# Altium schematic sheet Atmega.SchDoc
size A; SheetNumber: 1; SheetTotal: 1
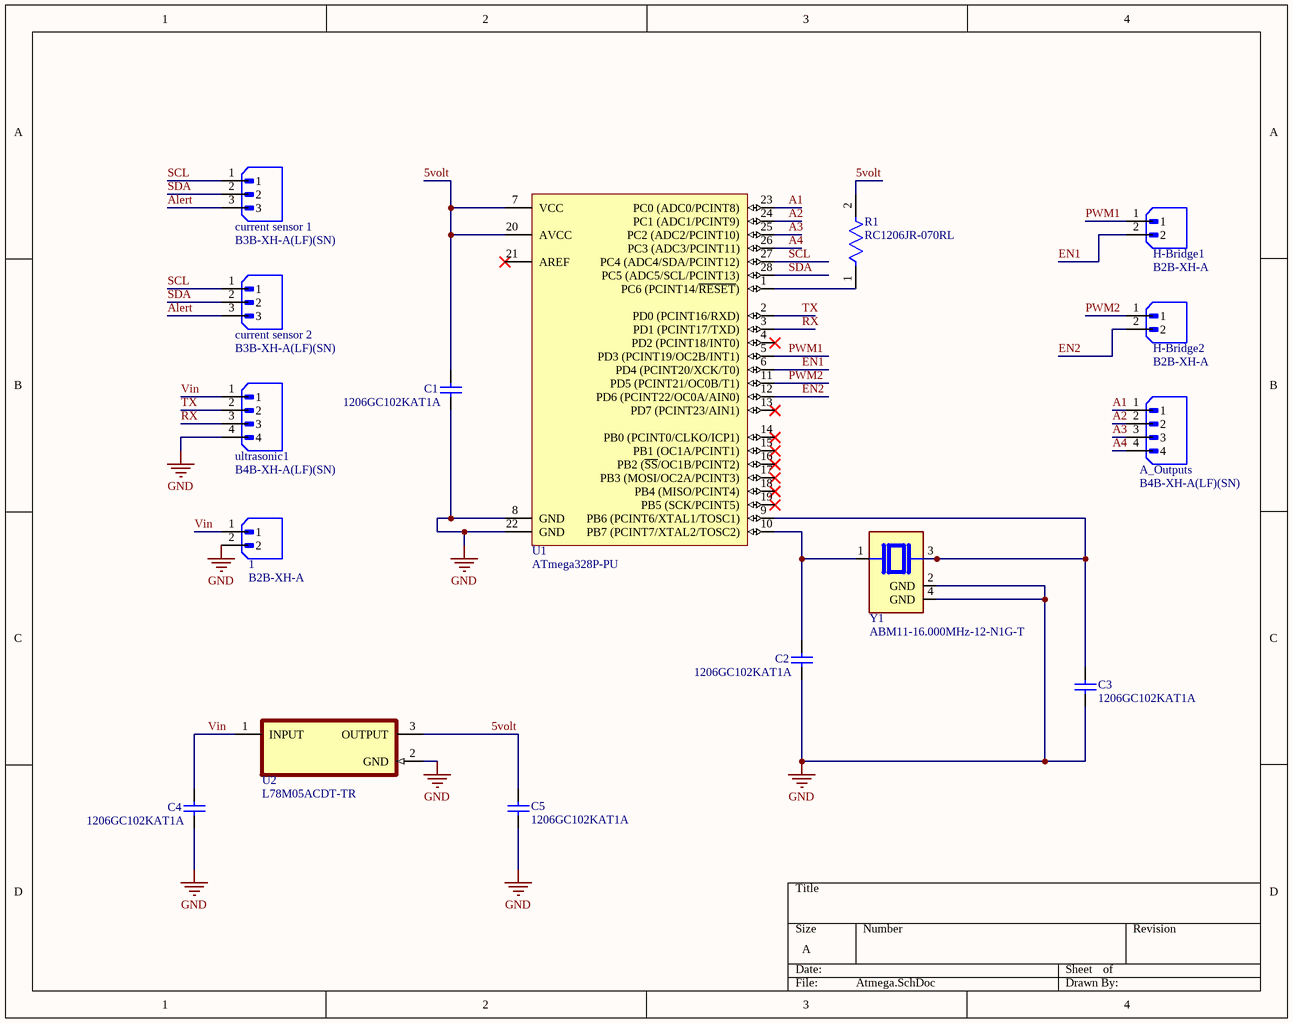
[diagram p0: Atmega.SchDoc]

## Parts
1  B2B-XH-A  [JST_B2B-XH-A]
A_Outputs  B4B-XH-A(LF)(SN)  [JST_B4B-XH-A(LF)(SN)]
C1  1206GC102KAT1A  [AVX-1206-2_L]
C2  1206GC102KAT1A  [AVX-1206-2_L]
C3  1206GC102KAT1A  [AVX-1206-2_L]
C4  1206GC102KAT1A  [AVX-1206-2_L]
C5  1206GC102KAT1A  [AVX-1206-2_L]
current_sensor_1  B3B-XH-A(LF)(SN)  [JST_B3B-XH-A(LF)(SN)]
current_sensor_2  B3B-XH-A(LF)(SN)  [JST_B3B-XH-A(LF)(SN)]
H-Bridge1  B2B-XH-A  [JST_B2B-XH-A]
H-Bridge2  B2B-XH-A  [JST_B2B-XH-A]
R1  RC1206JR-070RL  [FP-RC1206-MFG]
U1  ATmega328P-PU  [28P3]
U2  L78M05ACDT-TR  [DPAK228P972X240-4N]
ultrasonic1  B4B-XH-A(LF)(SN)  [JST_B4B-XH-A(LF)(SN)]
Y1  ABM11-16.000MHz-12-N1G-T  [XTAL_ABM11-16.000MHz-12-N1G-T]

## Nets
GND: 1.2 C1.1 C2.1 C3.1 C4.1 C5.2 U1.8(GND) U1.22(GND) U2.2(GND) ultrasonic1.4 Y1.2(GND) Y1.4(GND)
5volt: C1.2 C5.1 R1.2 U1.7(VCC) U1.20(AVCC) U2.3(OUTPUT)
A1: A_Outputs.1 U1.23(PC0_(ADC0/PCINT8))
A2: A_Outputs.2 U1.24(PC1_(ADC1/PCINT9))
A3: A_Outputs.3 U1.25(PC2_(ADC2/PCINT10))
A4: A_Outputs.4 U1.26(PC3_(ADC3/PCINT11))
Alert: current_sensor_1.3 current_sensor_2.3
EN1: H-Bridge1.2 U1.6(PD4_(PCINT20/XCK/T0))
EN2: H-Bridge2.2 U1.12(PD6_(PCINT22/OC0A/AIN0))
PWM1: H-Bridge1.1 U1.5(PD3_(PCINT19/OC2B/INT1))
PWM2: H-Bridge2.1 U1.11(PD5_(PCINT21/OC0B/T1))
RX: U1.3(PD1_(PCINT17/TXD)) ultrasonic1.3
SCL: current_sensor_1.1 current_sensor_2.1 U1.27(PC4_(ADC4/SDA/PCINT12))
SDA: current_sensor_1.2 current_sensor_2.2 U1.28(PC5_(ADC5/SCL/PCINT13))
TX: U1.2(PD0_(PCINT16/RXD)) ultrasonic1.2
Vin: 1.1 C4.2 U2.1(INPUT) ultrasonic1.1
NetC2_2: C2.2 U1.10(PB7_(PCINT7/XTAL2/TOSC2)) Y1.1
NetC3_2: C3.2 U1.9(PB6_(PCINT6/XTAL1/TOSC1)) Y1.3
NetR1_1: R1.1 U1.1(PC6_(PCINT14/~{RESET}))

Not connected (* = marked no-connect by the designer): U1 4(PD2_(PCINT18/INT0))* 13(PD7_(PCINT23/AIN1))* 14(PB0_(PCINT0/CLKO/ICP1))* 15(PB1_(OC1A/PCINT1))* 16(PB2_(~{SS}/OC1B/PCINT2))* 17(PB3_(MOSI/OC2A/PCINT3))* 18(PB4_(MISO/PCINT4))* 19(PB5_(SCK/PCINT5))* 21(AREF)*

## Library data of the parts
1 H-Bridge1 H-Bridge2 = B2B-XH-A: MF: {'manufacturer': u'JST Sales America Inc.'}; Package: None; Price: None; Value: *; MP: B2B-XH-A; Availability: Unavailable
A_Outputs ultrasonic1 = B4B-XH-A(LF)(SN): Connector Header Through Hole 4 position 0.098 (2.50mm); MF: JST Sales; SnapEDA_Link: https://www.snapeda.com/parts/B4B-XH-A(LF)(SN)/JST+Sales+America+Inc./view-part/?ref=snap; Package: None; Value: *; MP: B4B-XH-A(LF)(SN); Check_prices: https://www.snapeda.com/parts/B4B-XH-A(LF)(SN)/JST+Sales+America+Inc./view-part/?ref=eda
C1-C5 = CMP-2000-05468-1: Chip Capacitor, 1 nF, +/- 10%, -55 to 125 degC, 1206 (3216 Metric), RoHS, Tape and Reel; Manufacturer: AVX; Capacitance: 0.001uF; Dielectric: X7R; Voltage Rating DC: 2000V; Package Reference: 1206; Datasheet Version: 11/2010; Mounting Technology: SurfaceMount; Manufacturer URL: http://www.avx.com/; Tolerance: 10%; Tolerance (%): ±10%; PartNumber: 1206GC102KAT1A; Datasheet URL: https://datasheet.ciiva.com/11787/0900766b80ed4c37-11787781.pdf; Package Description: 2-Pin SMD, Body 3.4 x 1.8 mm; Case Size/Dimension: 1206; Rated Voltage: 2000V
current_sensor_1 current_sensor_2 = B3B-XH-A(LF)(SN): Connector Header Through Hole 3 position 0.098 (2.50mm); MF: JST Sales; SnapEDA_Link: https://www.snapeda.com/parts/B3B-XH-A(LF)(SN)/JST+Sales+America+Inc./view-part/?ref=snap; Package: None; Value: *; MP: B3B-XH-A(LF)(SN); Check_prices: https://www.snapeda.com/parts/B3B-XH-A(LF)(SN)/JST+Sales+America+Inc./view-part/?ref=eda
R1 = CMP-2100-03681-2: RES SMD 0 OHM JUMPER 1/4W 1206; Manufacturer: YAGEO; Voltage Rating: 200V; Temperature Coefficient: 300ppm/°C; Power Rating: 0.25W; Value: 0Ω; Tolerance: 5%; Manufacturer Part Number: RC1206JR-070RL; Temperature Range Low: -55°C; Category: Res; Automotive: No; Ipc Land Pattern Name: RESC310160X55; Device Class L1: Passive Components; Temperature: -55°C to +155°C; ComponentLink2URL: https://www.yageo.com/upload/media/product/productsearch/datasheet/rchip/PYu-RC_Group_51_RoHS_L_10.pdf; Lead Free: Yes; Height: 0.65mm; Footprint Url: https://www.yageo.com/upload/website/yageo_PYu-R_Mount_10_19050818_343.pdf; Package: RC1206; Digikey Description: RES SMD 0 OHM JUMPER 1/4W 1206; Temperature Range High: +155°C; Device Class L3: Chip SMD Resistors; Device Class L2: Resistors; Octopart: https://octopart.com/rc1206jr-070rl-yageo-40025601; Resistance: 0Ω; Series: RC; ComponentLink2Description: Datasheet; Composition: Thick Film; RoHS: TRUE; Mouser Description: Resistor: thick film; SMD; 1206; 0O; 0.25W; ±5%; -55÷155°C
U1 = CMP-0095-00013-2: 8-bit AVR Microcontroller, 32KB Flash, 1KB EEPROM, 2KB SRAM, 28-pin PDIP, Industrial Grade (-40°C to 85°C); RevisionNote: DatasheetVersion updated. URLs added.; PackageVersion: revB, Sep-2001; PackageDescription: 28-lead (0.300"/7.62mm Wide) Plastic Dual Inline Package (PDIP); DatasheetVersion: revD, May-2011; ComponentLink1Description: Manufacturer URL; ComponentLink1URL: http://www.atmel.com/; PackageReference: 28P3; ComponentLink2Description: ATmega48A/48PA/88A/88PA/168A/168PA/328/328P Datasheet; ComponentLink3URL: http://www.atmel.com/dyn/resources/prod_documents/8271S.pdf; ComponentLink2URL: http://www.atmel.com/dyn/resources/prod_documents/8271.pdf; ComponentLink3Description: ATmega48A/48PA/88A/88PA/168A/168PA/328/328P Summary
U2 = L78M05ACDT-TR: Linear Voltage Regulator IC 1 Output 500mA DPAK; MF: STMicroelectronics; Availability: Unavailable; MP: L78M05ACDT-TR; Price: None; Value: *; SnapEDA_Link: https://www.snapeda.com/parts/L78M05ACDT-TR/STMicroelectronics/view-part/274303/?ref=snap; Package: TO-252-3 STMicroelectronics
Y1 = ABM11-16.000MHz-12-N1G-T: MF: {'manufacturer': u'Abracon LLC'}; Package: None; Price: None; Value: *; MP: ABM11-16.000MHz-12-N1G-T; Availability: Unavailable